# EAGLE schematic edition4-Sensor (EAGLE 9.6.2)
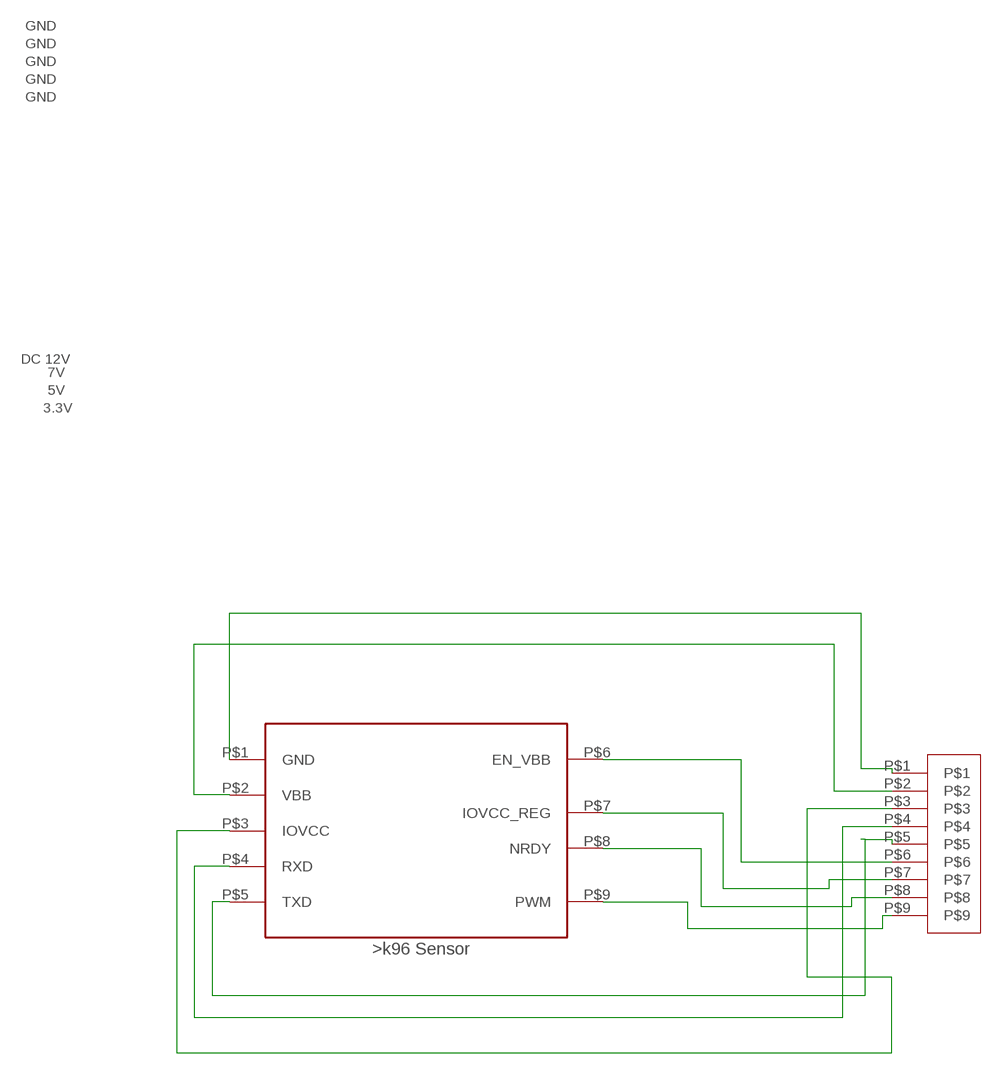
[diagram p0: schematic, sheet 1]

## Parts
U$1  K96SENSOR  [K96SENSOR]
U$2  9FEETPIN  [9FEETPIN]

## Nets
GND: U$1.P$1(GND) U$2.P$1
N$2: U$1.P$2(VBB) U$2.P$2
N$3: U$1.P$3(IOVCC) U$2.P$3
N$4: U$1.P$4(RXD) U$2.P$4
N$5: U$1.P$5(TXD) U$2.P$5
N$6: U$1.P$6(EN_VBB) U$2.P$6
N$7: U$1.P$7(IOVCC_REG) U$2.P$7
N$8: U$1.P$8(NRDY) U$2.P$8
N$9: U$1.P$9(PWM) U$2.P$9

## Notes on the sheet
- GND
- GND
- GND
- GND
- GND
- DC 12V
- 7V
- 5V
- 3.3V

## Library data of the parts
U$1 = untitled:K96SENSOR
U$2 = untitled:9FEETPIN